# EAGLE schematic netpwrV0.0 (EAGLE 7.5.0)
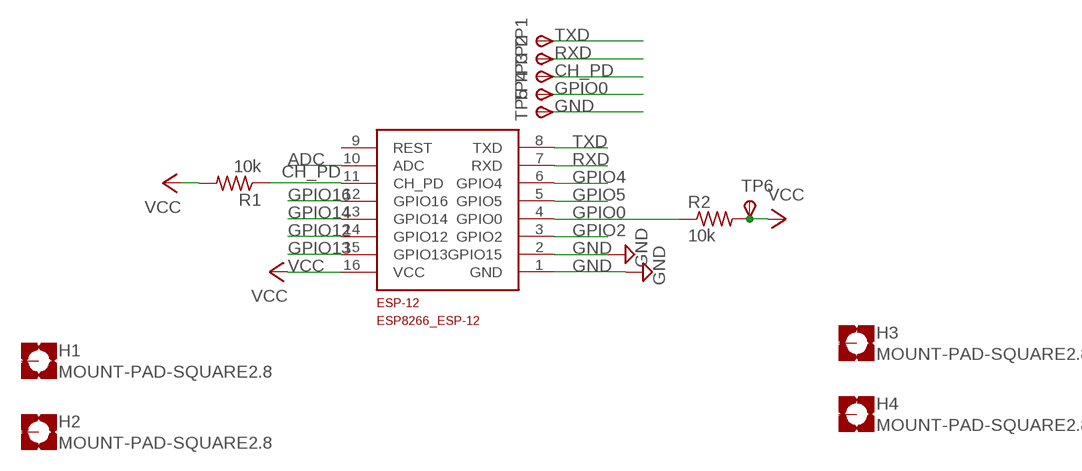
[diagram p0: schematic, sheet 1]

## Parts
ESP-12  ESP8266_ESP-12  [ESP8266-ESP12]
H1  MOUNT-PAD-SQUARE2.8  [2,8-PAD-SQUARE]
H2  MOUNT-PAD-SQUARE2.8  [2,8-PAD-SQUARE]
H3  MOUNT-PAD-SQUARE2.8  [2,8-PAD-SQUARE]
H4  MOUNT-PAD-SQUARE2.8  [2,8-PAD-SQUARE]
R1  10k  R-US_M1206  [M1206]
R2  10k  R-US_M1206  [M1206]
TP1  TPSTP15R  [TP15R]
TP2  TPSTP15R  [TP15R]
TP3  TPSTP15R  [TP15R]
TP4  TPSTP15R  [TP15R]
TP5  TPSTP15R  [TP15R]
TP6  TPSTP15R  [TP15R]

## Nets
ADC: ESP-12.10(ADC)
CH_PD: ESP-12.11(CH_PD) R1.1 TP3.TP(PP)
GND: ESP-12.1(GND) ESP-12.2(GPIO15) TP5.TP(PP)
GPIO0: ESP-12.4(GPIO0) R2.1 TP4.TP(PP)
GPIO2: ESP-12.3(GPIO2)
GPIO4: ESP-12.6(GPIO4)
GPIO5: ESP-12.5(GPIO5)
GPIO12: ESP-12.14(GPIO12)
GPIO13: ESP-12.15(GPIO13)
GPIO14: ESP-12.13(GPIO14)
GPIO16: ESP-12.12(GPIO16)
RXD: ESP-12.7(RXD) TP2.TP(PP)
TXD: ESP-12.8(TXD) TP1.TP(PP)
VCC: ESP-12.16(VCC) R1.2 R2.2 TP6.TP(PP)
Unconnected: ESP-12.9(REST) H1.B2,8(MOUNT) H2.B2,8(MOUNT) H3.B2,8(MOUNT) H4.B2,8(MOUNT)

## Library data of the parts
ESP-12 = ESP8266-ESP12:ESP8266_ESP-12
H1-H4 = holes:MOUNT-PAD-SQUARE: MOUNTING PAD, square
R1 R2 = rcl:R-US_: RESISTOR, American symbol
TP1-TP6 = testpad:TPS: TEST PIN